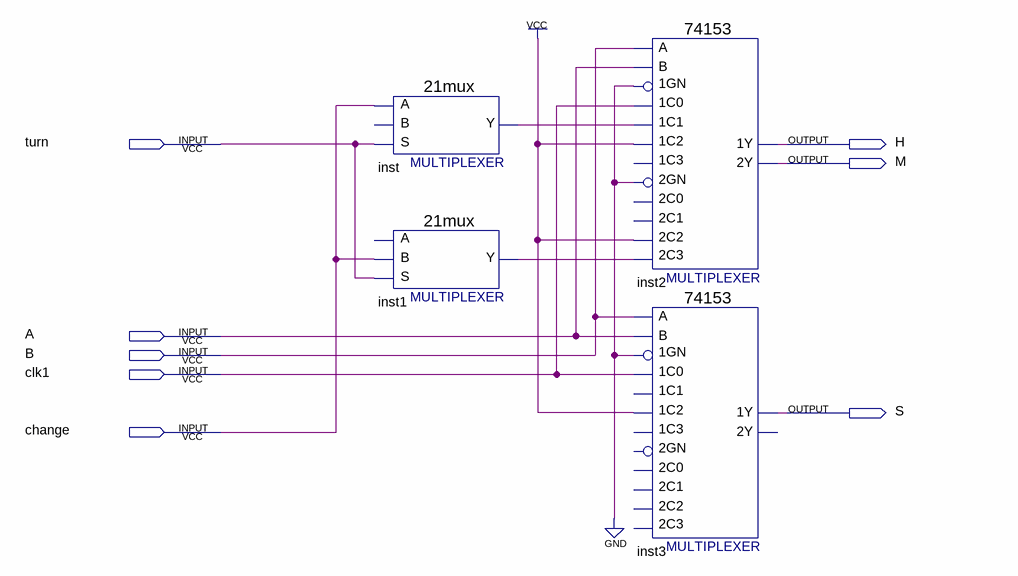
[diagram p0: schematic sheet]
// Quartus schematic control_main.bdf as structural Verilog: 4 symbols, 8 pins
module control_main (
  input  turn,
  input  A,
  input  B,
  input  clk1,
  input  change,
  output H,
  output M,
  output S
);

  wire inst1_y, inst_y;

  \21mux  inst (.S(turn), .A(change), .Y(inst_y));  // open: B
  \21mux  inst1 (.S(turn), .B(change), .Y(inst1_y));  // open: A
  \74153  inst2 (
    .\1C1 (inst_y), .\1GN (1'b0), .\1C0 (clk1), .\2GN (1'b0), .\2C2 (1'b1), .\1C2 (1'b1), .B(A), .A(B),
    .\2C3 (inst1_y), .\1Y (H), .\2Y (M));  // open: 2C0, 1C3, 2C1
  \74153  inst3 (
    .\1GN (1'b0), .\1C0 (clk1), .\1C2 (1'b1), .B(A), .A(B), .\1Y (S));  // open: 1C1, 2C0, 2GN, 2C2, 1C3, 2C1, 2C3, 2Y
endmodule
